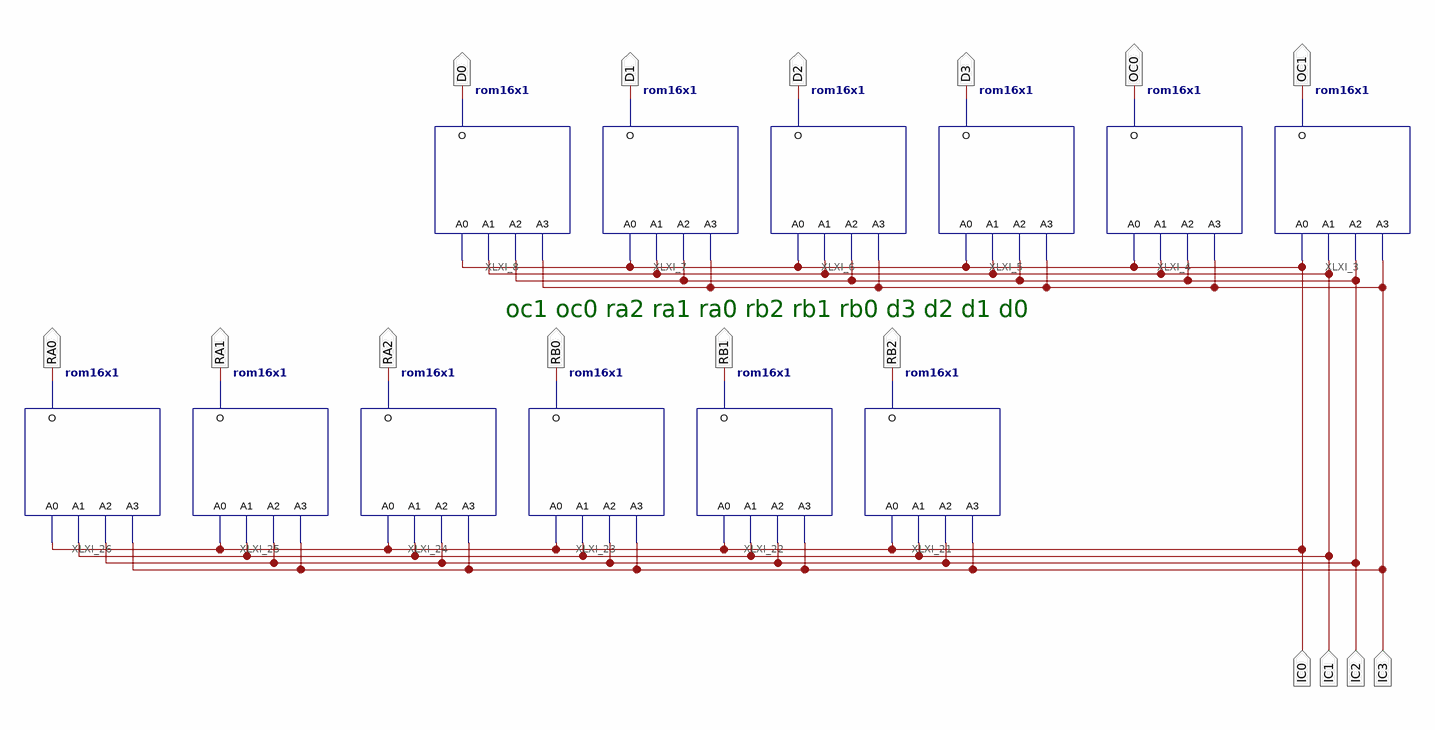
[diagram p0: schematic sheet 1]
// Xilinx ISE schematic ROMBANK.sch (spartan3e) as structural Verilog: 12 symbols, 16 ports
module ROMBANK (
  input  IC0,
  input  IC1,
  input  IC2,
  input  IC3,
  output D0,
  output D1,
  output D2,
  output D3,
  output OC0,
  output OC1,
  output RB2,
  output RB1,
  output RB0,
  output RA2,
  output RA1,
  output RA0
);

  rom16x1 #(.INIT("0013")) XLXI_3 (.A0(IC0), .A1(IC1), .A2(IC2), .A3(IC3), .O(OC1));
  rom16x1 #(.INIT("0018")) XLXI_4 (.A0(IC0), .A1(IC1), .A2(IC2), .A3(IC3), .O(OC0));
  rom16x1 #(.INIT("0000")) XLXI_5 (.A0(IC0), .A1(IC1), .A2(IC2), .A3(IC3), .O(D3));
  rom16x1 #(.INIT("0000")) XLXI_6 (.A0(IC0), .A1(IC1), .A2(IC2), .A3(IC3), .O(D2));
  rom16x1 #(.INIT("0011")) XLXI_7 (.A0(IC0), .A1(IC1), .A2(IC2), .A3(IC3), .O(D1));
  rom16x1 #(.INIT("0003")) XLXI_8 (.A0(IC0), .A1(IC1), .A2(IC2), .A3(IC3), .O(D0));
  rom16x1 XLXI_21 (.A0(IC0), .A1(IC1), .A2(IC2), .A3(IC3), .O(RB2));
  rom16x1 #(.INIT("0008")) XLXI_22 (.A0(IC0), .A1(IC1), .A2(IC2), .A3(IC3), .O(RB1));
  rom16x1 #(.INIT("0004")) XLXI_23 (.A0(IC0), .A1(IC1), .A2(IC2), .A3(IC3), .O(RB0));
  rom16x1 #(.INIT("0004")) XLXI_24 (.A0(IC0), .A1(IC1), .A2(IC2), .A3(IC3), .O(RA2));
  rom16x1 #(.INIT("0006")) XLXI_25 (.A0(IC0), .A1(IC1), .A2(IC2), .A3(IC3), .O(RA1));
  rom16x1 #(.INIT("001d")) XLXI_26 (.A0(IC0), .A1(IC1), .A2(IC2), .A3(IC3), .O(RA0));

  // Notes on the sheet:
  //   oc1 oc0 ra2 ra1 ra0 rb2 rb1 rb0 d3 d2 d1 d0
endmodule
